# Altium schematic sheet Emergancy.SchDoc
size A4; SheetNumber: 9; SheetTotal: 10
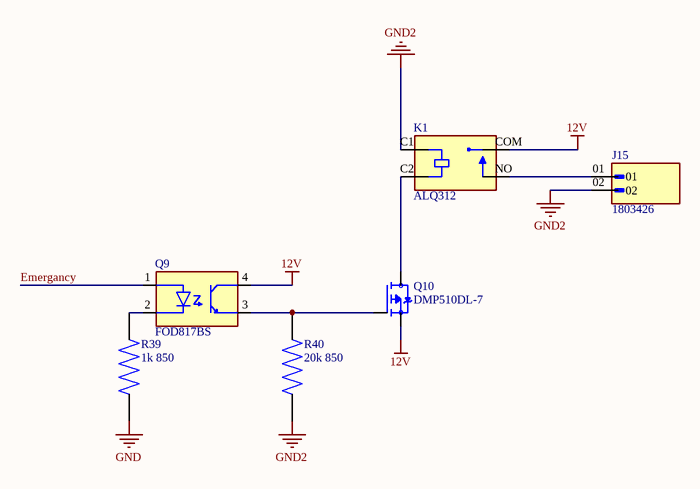
[diagram p0: Emergancy.SchDoc]

## Parts
J15  1803426  [PHOENIX_1803426]
K1  ALQ312  [RELAY_ALQ312]
Q9  FOD817BS  [SOIC254P1016X385-4N]
Q10  DMP510DL-7  [SOT91P240X110-3N - duplicate]
R39  1k 850  [10k 850]
R40  20k 850  [10k 850]

## Nets
12V: K1.COM Q9.4(COLLECTOR) Q10.2(S)
GND: R39.2
GND2: J15.02 K1.C1(COIL1) R40.2
Emergancy: Q9.1(ANODE)
NetJ15_01: J15.01 K1.NO
NetK1_C2: K1.C2(COIL2) Q10.3(D)
NetQ9_2: Q9.2(CATHODE) R39.1
NetQ9_3: Q9.3(EMITTER) Q10.1(G) R40.1

## Library data of the parts
J15 = 1803426: Pluggable Header 3.81mm 16AWG 160V 8A 2 Position COMBICON MCV Series | Phoenix Contact 1803426; SnapEDA_Link: https://www.snapeda.com/parts/1803426/Phoenix+Contact/view-part/?ref=snap; Package: None; Value: *; MF: Phoenix Contact; MP: 1803426; Check_prices: https://www.snapeda.com/parts/1803426/Phoenix+Contact/view-part/?ref=eda
K1 = ALQ312: General Purpose Relay SPST-NO (1 Form A) 12VDC Coil Through Hole; MF: Panasonic Electric; Package: DIP-4; Price: None; Value: *; SnapEDA_Link: https://www.snapeda.com/parts/ALQ312/Panasonic+Electric+Works/view-part/?ref=snap; MP: ALQ312; Availability: Unavailable; Check_prices: https://www.snapeda.com/parts/ALQ312/Panasonic+Electric+Works/view-part/?ref=eda
Q9 = FOD817BS: Transistor Output Optocouplers Opto Phototransistor Output SM-DIP4; MF: ON Semiconductor; SnapEDA_Link: https://www.snapeda.com/parts/FOD817BS/Onsemi/view-part/?ref=snap; Package: SMD-4 ON Semiconductor; Value: *; MP: FOD817BS; Check_prices: https://www.snapeda.com/parts/FOD817BS/Onsemi/view-part/?ref=eda
R39 R40 = 10k 850